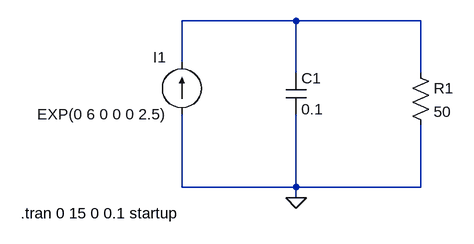
[diagram p0: schematic project 2 q1.asc]
project 2 q1.asc, the LTspice schematic file:
Version 4
SHEET 1 880 680
WIRE 304 64 128 64
WIRE 496 64 304 64
WIRE 128 128 128 64
WIRE 304 144 304 64
WIRE 496 144 496 64
WIRE 128 320 128 208
WIRE 304 320 304 208
WIRE 304 320 128 320
WIRE 496 320 496 224
WIRE 496 320 304 320
WIRE 304 336 304 320
FLAG 304 336 0
SYMBOL current 128 208 R180
WINDOW 0 24 88 Left 0
WINDOW 3 24 0 Left 0
WINDOW 123 0 0 Left 0
WINDOW 39 0 0 Left 0
SYMATTR InstName I1
SYMATTR Value EXP(0 6 0 0 0 2.5)
SYMBOL cap 288 144 R0
SYMATTR InstName C1
SYMATTR Value 0.1
SYMBOL res 480 128 R0
SYMATTR InstName R1
SYMATTR Value 50
TEXT -120 360 Left 0 !.tran 0 15 0 0.1 startup

The netlist it stands for:
* project 2 q1.asc
I1 0 N001 EXP(0 6 0 0 0 2.5)
C1 N001 0 0.1
R1 N001 0 50
.tran 0 15 0 0.1 startup
.backanno
.end